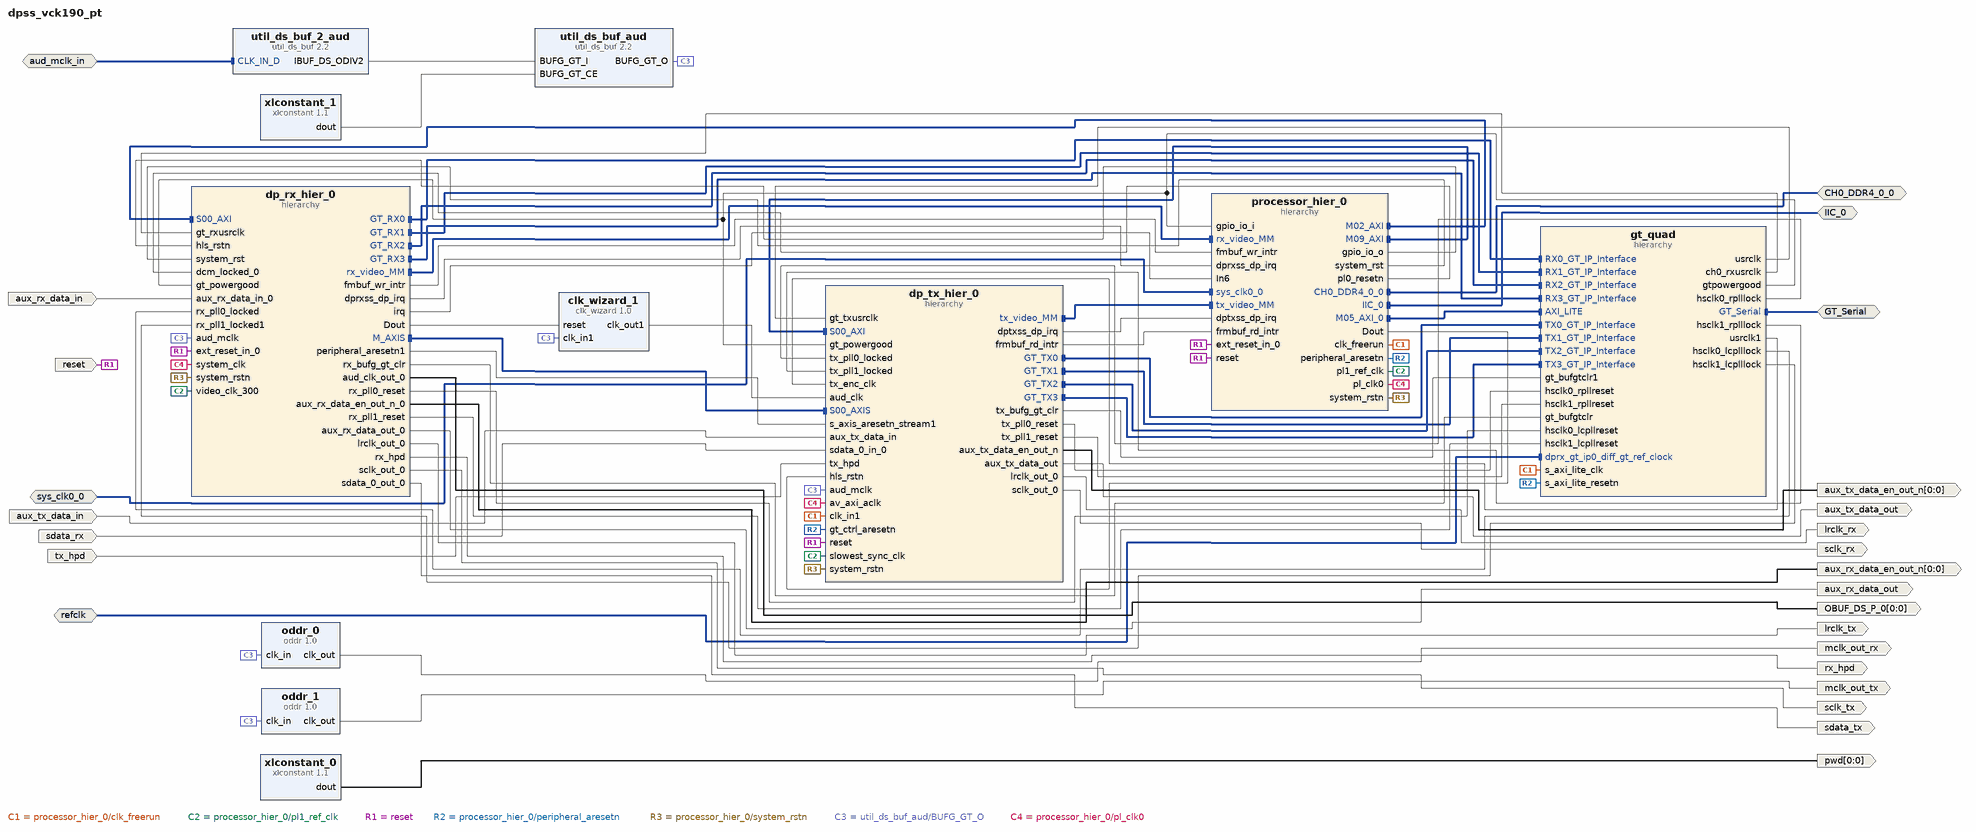
[diagram p0: block diagram of the top level]
# Vivado block design dpss_vck190_pt, xcvc1902-vsva2197-2MP-e-S, Vivado 2023.2
create_bd_design dpss_vck190_pt

create_bd_intf_port -mode Master -vlnv xilinx.com:interface:gt_rtl:1.0 GT_Serial
create_bd_intf_port -mode Master -vlnv xilinx.com:interface:ddr4_rtl:1.0 CH0_DDR4_0_0
create_bd_intf_port -mode Master -vlnv xilinx.com:interface:iic_rtl:1.0 IIC_0
create_bd_intf_port -mode Slave -vlnv xilinx.com:interface:diff_clock_rtl:1.0 aud_mclk_in
set_property -dict {CONFIG.FREQ_HZ 36864000} [get_bd_intf_ports aud_mclk_in]
create_bd_intf_port -mode Slave -vlnv xilinx.com:interface:diff_clock_rtl:1.0 refclk
create_bd_intf_port -mode Slave -vlnv xilinx.com:interface:diff_clock_rtl:1.0 sys_clk0_0
set_property -dict {CONFIG.FREQ_HZ 200000000} [get_bd_intf_ports sys_clk0_0]
create_bd_port -dir O -from 0 -to 0 -type clk OBUF_DS_P_0
create_bd_port -dir O -from 0 -to 0 aux_rx_data_en_out_n
create_bd_port -dir I aux_rx_data_in
create_bd_port -dir O aux_rx_data_out
create_bd_port -dir O -from 0 -to 0 aux_tx_data_en_out_n
create_bd_port -dir I aux_tx_data_in
create_bd_port -dir O aux_tx_data_out
create_bd_port -dir O lrclk_rx
create_bd_port -dir O lrclk_tx
create_bd_port -dir O -type clk mclk_out_rx
create_bd_port -dir O -type clk mclk_out_tx
create_bd_port -dir O -from 0 -to 0 pwd
create_bd_port -dir I -type rst reset
set_property -dict {CONFIG.POLARITY ACTIVE_HIGH} [get_bd_ports reset]
create_bd_port -dir O -type data rx_hpd
create_bd_port -dir O sclk_rx
create_bd_port -dir O sclk_tx
create_bd_port -dir I sdata_rx
create_bd_port -dir O sdata_tx
create_bd_port -dir I -type data tx_hpd

create_bd_cell -type hier gt_quad
create_bd_cell -type ip -vlnv xilinx.com:ip:clk_wizard:1.0 clk_wizard_1
set_property -dict [list \
  CONFIG.CLKOUT_DRIVES BUFG,BUFG,BUFG,BUFG,BUFG,BUFG,BUFG \
  CONFIG.CLKOUT_DYN_PS None,None,None,None,None,None,None \
  CONFIG.CLKOUT_MATCHED_ROUTING false,false,false,false,false,false,false \
  CONFIG.CLKOUT_PORT clk_out1,clk_out2,clk_out3,clk_out4,clk_out5,clk_out6,clk_out7 \
  CONFIG.CLKOUT_REQUESTED_DUTY_CYCLE 50.000,50.000,50.000,50.000,50.000,50.000,50.000 \
  CONFIG.CLKOUT_REQUESTED_OUT_FREQUENCY 24.576,36.864,100.000,100.000,100.000,100.000,100.000 \
  CONFIG.CLKOUT_REQUESTED_PHASE 0.000,0.000,0.000,0.000,0.000,0.000,0.000 \
  CONFIG.CLKOUT_USED true,false,false,false,false,false,false \
  CONFIG.PRIM_IN_FREQ 36.864 \
  CONFIG.PRIM_SOURCE No_buffer \
  CONFIG.USE_RESET true \
] [get_bd_cells clk_wizard_1]
create_bd_cell -type hier dp_rx_hier_0
create_bd_cell -type hier dp_tx_hier_0
create_bd_cell -type ip -vlnv xilinx.com:ip:oddr:1.0 oddr_0
create_bd_cell -type ip -vlnv xilinx.com:ip:oddr:1.0 oddr_1
create_bd_cell -type hier processor_hier_0
create_bd_cell -type ip -vlnv xilinx.com:ip:util_ds_buf:2.2 util_ds_buf_2_aud
set_property -dict {CONFIG.C_BUF_TYPE IBUFDSGTE} [get_bd_cells util_ds_buf_2_aud]
create_bd_cell -type ip -vlnv xilinx.com:ip:util_ds_buf:2.2 util_ds_buf_aud
set_property -dict {CONFIG.C_BUF_TYPE BUFG_GT} [get_bd_cells util_ds_buf_aud]
create_bd_cell -type ip -vlnv xilinx.com:ip:xlconstant:1.1 xlconstant_0
set_property -dict {CONFIG.CONST_VAL 0} [get_bd_cells xlconstant_0]
create_bd_cell -type ip -vlnv xilinx.com:ip:xlconstant:1.1 xlconstant_1

# ---- hierarchy /gt_quad ----
current_bd_instance /gt_quad
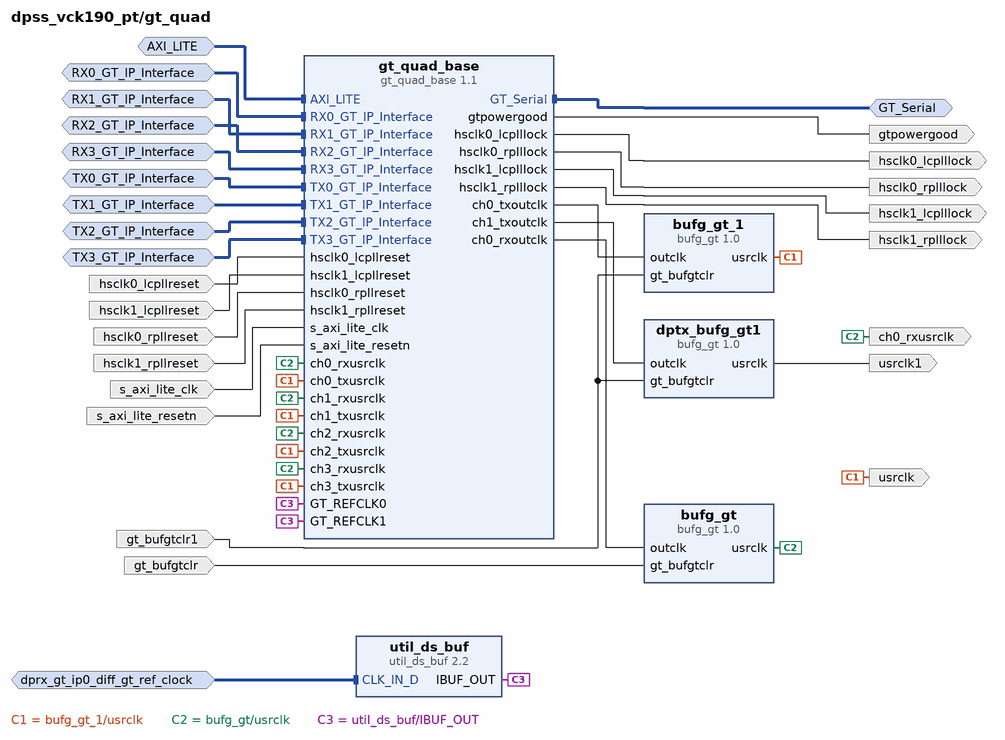
[diagram p1: block diagram inside /gt_quad]
create_bd_intf_pin -mode Slave -vlnv xilinx.com:interface:gt_tx_interface_rtl:1.0 TX0_GT_IP_Interface
create_bd_intf_pin -mode Slave -vlnv xilinx.com:interface:gt_tx_interface_rtl:1.0 TX1_GT_IP_Interface
create_bd_intf_pin -mode Slave -vlnv xilinx.com:interface:gt_tx_interface_rtl:1.0 TX2_GT_IP_Interface
create_bd_intf_pin -mode Slave -vlnv xilinx.com:interface:gt_tx_interface_rtl:1.0 TX3_GT_IP_Interface
create_bd_intf_pin -mode Slave -vlnv xilinx.com:interface:gt_rx_interface_rtl:1.0 RX0_GT_IP_Interface
create_bd_intf_pin -mode Slave -vlnv xilinx.com:interface:gt_rx_interface_rtl:1.0 RX1_GT_IP_Interface
create_bd_intf_pin -mode Slave -vlnv xilinx.com:interface:gt_rx_interface_rtl:1.0 RX2_GT_IP_Interface
create_bd_intf_pin -mode Slave -vlnv xilinx.com:interface:gt_rx_interface_rtl:1.0 RX3_GT_IP_Interface
create_bd_intf_pin -mode Master -vlnv xilinx.com:interface:gt_rtl:1.0 GT_Serial
create_bd_intf_pin -mode Slave -vlnv xilinx.com:interface:diff_clock_rtl:1.0 dprx_gt_ip0_diff_gt_ref_clock
create_bd_intf_pin -mode Slave -vlnv xilinx.com:interface:aximm_rtl:1.0 AXI_LITE
create_bd_pin -dir I gt_bufgtclr
create_bd_pin -dir O -type gt_usrclk ch0_rxusrclk
create_bd_pin -dir I -type rst hsclk0_lcpllreset
create_bd_pin -dir I -type rst hsclk0_rpllreset
create_bd_pin -dir I -type rst hsclk1_lcpllreset
create_bd_pin -dir I -type rst hsclk1_rpllreset
create_bd_pin -dir O hsclk0_lcplllock
create_bd_pin -dir O hsclk1_lcplllock
create_bd_pin -dir O hsclk0_rplllock
create_bd_pin -dir O hsclk1_rplllock
create_bd_pin -dir O gtpowergood
create_bd_pin -dir O -type gt_usrclk usrclk
create_bd_pin -dir I gt_bufgtclr1
create_bd_pin -dir O -type gt_usrclk usrclk1
create_bd_pin -dir I -type clk s_axi_lite_clk
create_bd_pin -dir I -type rst s_axi_lite_resetn

create_bd_cell -type ip -vlnv xilinx.com:ip:bufg_gt:1.0 bufg_gt
create_bd_cell -type ip -vlnv xilinx.com:ip:gt_quad_base:1.1 gt_quad_base
set_property -dict [list \
  CONFIG.APB3_CLK_FREQUENCY 99.999001 \
  CONFIG.CHANNEL_ORDERING {['/gt_quad/gt_quad_base/TX0_GT_IP_Interface dpss_vck190_pt_dptx_gt_ip0_0./dp_tx_hier_0/dptx_gt_ip0/GT_TX0.0 /gt_quad/gt_quad_base/TX1_GT_IP_Interface', 'dpss_vck190_pt_dptx_gt_ip0_0./dp_tx_hier_0/dptx_gt_ip0/GT_TX1.1 /gt_quad/gt_quad_base/TX2_GT_IP_Interface dpss_vck190_pt_dptx_gt_ip0_0./dp_tx_hier_0/dptx_gt_ip0/GT_TX2.2', '/gt_quad/gt_quad_base/TX3_GT_IP_Interface dpss_vck190_pt_dptx_gt_ip0_0./dp_tx_hier_0/dptx_gt_ip0/GT_TX3.3 /gt_quad/gt_quad_base/RX0_GT_IP_Interface', 'dpss_vck190_pt_dprx_gt_ip0_0./dp_rx_hier_0/dprx_gt_ip0/GT_RX0.0 /gt_quad/gt_quad_base/RX1_GT_IP_Interface dpss_vck190_pt_dprx_gt_ip0_0./dp_rx_hier_0/dprx_gt_ip0/GT_RX1.1', '/gt_quad/gt_quad_base/RX2_GT_IP_Interface dpss_vck190_pt_dprx_gt_ip0_0./dp_rx_hier_0/dprx_gt_ip0/GT_RX2.2 /gt_quad/gt_quad_base/RX3_GT_IP_Interface', 'dpss_vck190_pt_dprx_gt_ip0_0./dp_rx_hier_0/dprx_gt_ip0/GT_RX3.3']} \
  CONFIG.GT_TYPE GTY \
  CONFIG.PORTS_INFO_DICT {LANE_SEL_DICT {PROT0 {RX0 RX1 RX2 RX3} PROT1 {TX0 TX1 TX2 TX3}} GT_TYPE GTY REG_CONF_INTF AXI_LITE BOARD_PARAMETER { }} \
  CONFIG.PROT0_ENABLE true \
  CONFIG.PROT0_GT_DIRECTION SIMPLEX_RX \
  CONFIG.PROT0_LR0_SETTINGS {['TX_PAM_SEL NRZ TX_HD_EN 0 TX_GRAY_BYP true TX_GRAY_LITTLEENDIAN true TX_PRECODE_BYP true TX_PRECODE_LITTLEENDIAN false TX_LINE_RATE 10.3125 TX_PLL_TYPE LCPLL TX_REFCLK_FREQUENCY 156.25', 'TX_ACTUAL_REFCLK_FREQUENCY 156.250000000000 TX_FRACN_ENABLED false TX_FRACN_OVRD false TX_FRACN_NUMERATOR 0 TX_REFCLK_SOURCE R0 TX_DATA_ENCODING RAW TX_USER_DATA_WIDTH 32 TX_INT_DATA_WIDTH 32', 'TX_BUFFER_MODE 1 TX_BUFFER_BYPASS_MODE Fast_Sync TX_PIPM_ENABLE false TX_OUTCLK_SOURCE TXOUTCLKPMA TXPROGDIV_FREQ_ENABLE false TXPROGDIV_FREQ_SOURCE LCPLL TXPROGDIV_FREQ_VAL 322.265625', 'TX_DIFF_SWING_EMPH_MODE CUSTOM TX_64B66B_SCRAMBLER false TX_64B66B_ENCODER false TX_64B66B_CRC false TX_RATE_GROUP A TX_LANE_DESKEW_HDMI_ENABLE false TX_BUFFER_RESET_ON_RATE_CHANGE ENABLE GT_DIRECTION', 'SIMPLEX_RX PRESET None RX_PAM_SEL NRZ RX_HD_EN 0 RX_GRAY_BYP true RX_GRAY_LITTLEENDIAN true RX_PRECODE_BYP true RX_PRECODE_LITTLEENDIAN false INTERNAL_PRESET None RX_LINE_RATE 1.62 RX_PLL_TYPE LCPLL', 'RX_REFCLK_FREQUENCY 270 RX_ACTUAL_REFCLK_FREQUENCY 270.000000000000 RX_FRACN_ENABLED false RX_FRACN_OVRD false RX_FRACN_NUMERATOR 0 RX_REFCLK_SOURCE R0 RX_DATA_DECODING RAW RX_USER_DATA_WIDTH 16', 'RX_INT_DATA_WIDTH 16 RX_BUFFER_MODE 1 RX_OUTCLK_SOURCE RXPROGDIVCLK RXPROGDIV_FREQ_ENABLE true RXPROGDIV_FREQ_SOURCE LCPLL RXPROGDIV_FREQ_VAL 101.250 RXRECCLK_FREQ_ENABLE true RXRECCLK_FREQ_VAL', '810.000 INS_LOSS_NYQ 14 RX_EQ_MODE LPM RX_COUPLING AC RX_TERMINATION PROGRAMMABLE RX_RATE_GROUP A RX_TERMINATION_PROG_VALUE 800 RX_PPM_OFFSET 300 RX_64B66B_DESCRAMBLER false RX_64B66B_DECODER false', 'RX_64B66B_CRC false OOB_ENABLE false RX_COMMA_ALIGN_WORD 1 RX_COMMA_SHOW_REALIGN_ENABLE true PCIE_ENABLE false RX_COMMA_P_ENABLE false RX_COMMA_M_ENABLE false RX_COMMA_DOUBLE_ENABLE false', 'RX_COMMA_P_VAL 0101111100 RX_COMMA_M_VAL 1010000011 RX_COMMA_MASK 0000000000 RX_SLIDE_MODE OFF RX_SSC_PPM 5000 RX_CB_NUM_SEQ 0 RX_CB_LEN_SEQ 1 RX_CB_MAX_SKEW 1 RX_CB_MAX_LEVEL 1 RX_CB_MASK 00000000', 'RX_CB_VAL 00000000000000000000000000000000000000000000000000000000000000000000000000000000 RX_CB_K 00000000 RX_CB_DISP 00000000 RX_CB_MASK_0_0 false RX_CB_VAL_0_0 00000000 RX_CB_K_0_0 false', 'RX_CB_DISP_0_0 false RX_CB_MASK_0_1 false RX_CB_VAL_0_1 00000000 RX_CB_K_0_1 false RX_CB_DISP_0_1 false RX_CB_MASK_0_2 false RX_CB_VAL_0_2 00000000 RX_CB_K_0_2 false RX_CB_DISP_0_2 false', 'RX_CB_MASK_0_3 false RX_CB_VAL_0_3 00000000 RX_CB_K_0_3 false RX_CB_DISP_0_3 false RX_CB_MASK_1_0 false RX_CB_VAL_1_0 00000000 RX_CB_K_1_0 false RX_CB_DISP_1_0 false RX_CB_MASK_1_1 false RX_CB_VAL_1_1', '00000000 RX_CB_K_1_1 false RX_CB_DISP_1_1 false RX_CB_MASK_1_2 false RX_CB_VAL_1_2 00000000 RX_CB_K_1_2 false RX_CB_DISP_1_2 false RX_CB_MASK_1_3 false RX_CB_VAL_1_3 00000000 RX_CB_K_1_3 false', 'RX_CB_DISP_1_3 false RX_CC_NUM_SEQ 0 RX_CC_LEN_SEQ 1 RX_CC_PERIODICITY 5000 RX_CC_KEEP_IDLE DISABLE RX_CC_PRECEDENCE ENABLE RX_CC_REPEAT_WAIT 0 RX_CC_MASK 00000000 RX_CC_VAL', '00000000000000000000000000000000000000000000000000000000000000000000000000000000 RX_CC_K 00000000 RX_CC_DISP 00000000 RX_CC_MASK_0_0 false RX_CC_VAL_0_0 00000000 RX_CC_K_0_0 false RX_CC_DISP_0_0 false', 'RX_CC_MASK_0_1 false RX_CC_VAL_0_1 00000000 RX_CC_K_0_1 false RX_CC_DISP_0_1 false RX_CC_MASK_0_2 false RX_CC_VAL_0_2 00000000 RX_CC_K_0_2 false RX_CC_DISP_0_2 false RX_CC_MASK_0_3 false RX_CC_VAL_0_3', '00000000 RX_CC_K_0_3 false RX_CC_DISP_0_3 false RX_CC_MASK_1_0 false RX_CC_VAL_1_0 00000000 RX_CC_K_1_0 false RX_CC_DISP_1_0 false RX_CC_MASK_1_1 false RX_CC_VAL_1_1 00000000 RX_CC_K_1_1 false', 'RX_CC_DISP_1_1 false RX_CC_MASK_1_2 false RX_CC_VAL_1_2 00000000 RX_CC_K_1_2 false RX_CC_DISP_1_2 false RX_CC_MASK_1_3 false RX_CC_VAL_1_3 00000000 RX_CC_K_1_3 false RX_CC_DISP_1_3 false', 'PCIE_USERCLK2_FREQ 250 PCIE_USERCLK_FREQ 250 RX_JTOL_FC 0.9718056 RX_JTOL_LF_SLOPE -20 RX_BUFFER_BYPASS_MODE Fast_Sync RX_BUFFER_BYPASS_MODE_LANE MULTI RX_BUFFER_RESET_ON_CB_CHANGE ENABLE', 'RX_BUFFER_RESET_ON_COMMAALIGN DISABLE RX_BUFFER_RESET_ON_RATE_CHANGE ENABLE RESET_SEQUENCE_INTERVAL 0 RX_COMMA_PRESET NONE RX_COMMA_VALID_ONLY 0 GT_TYPE GTY']} \
  CONFIG.PROT0_LR10_SETTINGS {NA NA} \
  CONFIG.PROT0_LR11_SETTINGS {NA NA} \
  CONFIG.PROT0_LR12_SETTINGS {NA NA} \
  CONFIG.PROT0_LR13_SETTINGS {NA NA} \
  CONFIG.PROT0_LR14_SETTINGS {NA NA} \
  CONFIG.PROT0_LR15_SETTINGS {NA NA} \
  CONFIG.PROT0_LR1_SETTINGS {['TX_PAM_SEL NRZ TX_HD_EN 0 TX_GRAY_BYP true TX_GRAY_LITTLEENDIAN true TX_PRECODE_BYP true TX_PRECODE_LITTLEENDIAN false TX_LINE_RATE 10.3125 TX_PLL_TYPE LCPLL TX_REFCLK_FREQUENCY 156.25', 'TX_ACTUAL_REFCLK_FREQUENCY 156.250000000000 TX_FRACN_ENABLED false TX_FRACN_OVRD false TX_FRACN_NUMERATOR 0 TX_REFCLK_SOURCE R0 TX_DATA_ENCODING RAW TX_USER_DATA_WIDTH 32 TX_INT_DATA_WIDTH 32', 'TX_BUFFER_MODE 1 TX_BUFFER_BYPASS_MODE Fast_Sync TX_PIPM_ENABLE false TX_OUTCLK_SOURCE TXOUTCLKPMA TXPROGDIV_FREQ_ENABLE false TXPROGDIV_FREQ_SOURCE LCPLL TXPROGDIV_FREQ_VAL 322.265625', 'TX_DIFF_SWING_EMPH_MODE CUSTOM TX_64B66B_SCRAMBLER false TX_64B66B_ENCODER false TX_64B66B_CRC false TX_RATE_GROUP A TX_LANE_DESKEW_HDMI_ENABLE false TX_BUFFER_RESET_ON_RATE_CHANGE ENABLE GT_DIRECTION', 'SIMPLEX_RX PRESET None RX_PAM_SEL NRZ RX_HD_EN 0 RX_GRAY_BYP true RX_GRAY_LITTLEENDIAN true RX_PRECODE_BYP true RX_PRECODE_LITTLEENDIAN false INTERNAL_PRESET None RX_LINE_RATE 2.7 RX_PLL_TYPE LCPLL', 'RX_REFCLK_FREQUENCY 270 RX_ACTUAL_REFCLK_FREQUENCY 270.000000000000 RX_FRACN_ENABLED false RX_FRACN_OVRD false RX_FRACN_NUMERATOR 0 RX_REFCLK_SOURCE R0 RX_DATA_DECODING RAW RX_USER_DATA_WIDTH 16', 'RX_INT_DATA_WIDTH 16 RX_BUFFER_MODE 1 RX_OUTCLK_SOURCE RXPROGDIVCLK RXPROGDIV_FREQ_ENABLE true RXPROGDIV_FREQ_SOURCE LCPLL RXPROGDIV_FREQ_VAL 168.750 RXRECCLK_FREQ_ENABLE true RXRECCLK_FREQ_VAL', '675.000 INS_LOSS_NYQ 14 RX_EQ_MODE LPM RX_COUPLING AC RX_TERMINATION PROGRAMMABLE RX_RATE_GROUP A RX_TERMINATION_PROG_VALUE 800 RX_PPM_OFFSET 300 RX_64B66B_DESCRAMBLER false RX_64B66B_DECODER false', 'RX_64B66B_CRC false OOB_ENABLE false RX_COMMA_ALIGN_WORD 1 RX_COMMA_SHOW_REALIGN_ENABLE true PCIE_ENABLE false RX_COMMA_P_ENABLE false RX_COMMA_M_ENABLE false RX_COMMA_DOUBLE_ENABLE false', 'RX_COMMA_P_VAL 0101111100 RX_COMMA_M_VAL 1010000011 RX_COMMA_MASK 0000000000 RX_SLIDE_MODE OFF RX_SSC_PPM 5000 RX_CB_NUM_SEQ 0 RX_CB_LEN_SEQ 1 RX_CB_MAX_SKEW 1 RX_CB_MAX_LEVEL 1 RX_CB_MASK 00000000', 'RX_CB_VAL 00000000000000000000000000000000000000000000000000000000000000000000000000000000 RX_CB_K 00000000 RX_CB_DISP 00000000 RX_CB_MASK_0_0 false RX_CB_VAL_0_0 00000000 RX_CB_K_0_0 false', 'RX_CB_DISP_0_0 false RX_CB_MASK_0_1 false RX_CB_VAL_0_1 00000000 RX_CB_K_0_1 false RX_CB_DISP_0_1 false RX_CB_MASK_0_2 false RX_CB_VAL_0_2 00000000 RX_CB_K_0_2 false RX_CB_DISP_0_2 false', 'RX_CB_MASK_0_3 false RX_CB_VAL_0_3 00000000 RX_CB_K_0_3 false RX_CB_DISP_0_3 false RX_CB_MASK_1_0 false RX_CB_VAL_1_0 00000000 RX_CB_K_1_0 false RX_CB_DISP_1_0 false RX_CB_MASK_1_1 false RX_CB_VAL_1_1', '00000000 RX_CB_K_1_1 false RX_CB_DISP_1_1 false RX_CB_MASK_1_2 false RX_CB_VAL_1_2 00000000 RX_CB_K_1_2 false RX_CB_DISP_1_2 false RX_CB_MASK_1_3 false RX_CB_VAL_1_3 00000000 RX_CB_K_1_3 false', 'RX_CB_DISP_1_3 false RX_CC_NUM_SEQ 0 RX_CC_LEN_SEQ 1 RX_CC_PERIODICITY 5000 RX_CC_KEEP_IDLE DISABLE RX_CC_PRECEDENCE ENABLE RX_CC_REPEAT_WAIT 0 RX_CC_MASK 00000000 RX_CC_VAL', '00000000000000000000000000000000000000000000000000000000000000000000000000000000 RX_CC_K 00000000 RX_CC_DISP 00000000 RX_CC_MASK_0_0 false RX_CC_VAL_0_0 00000000 RX_CC_K_0_0 false RX_CC_DISP_0_0 false', 'RX_CC_MASK_0_1 false RX_CC_VAL_0_1 00000000 RX_CC_K_0_1 false RX_CC_DISP_0_1 false RX_CC_MASK_0_2 false RX_CC_VAL_0_2 00000000 RX_CC_K_0_2 false RX_CC_DISP_0_2 false RX_CC_MASK_0_3 false RX_CC_VAL_0_3', '00000000 RX_CC_K_0_3 false RX_CC_DISP_0_3 false RX_CC_MASK_1_0 false RX_CC_VAL_1_0 00000000 RX_CC_K_1_0 false RX_CC_DISP_1_0 false RX_CC_MASK_1_1 false RX_CC_VAL_1_1 00000000 RX_CC_K_1_1 false', 'RX_CC_DISP_1_1 false RX_CC_MASK_1_2 false RX_CC_VAL_1_2 00000000 RX_CC_K_1_2 false RX_CC_DISP_1_2 false RX_CC_MASK_1_3 false RX_CC_VAL_1_3 00000000 RX_CC_K_1_3 false RX_CC_DISP_1_3 false', 'PCIE_USERCLK2_FREQ 250 PCIE_USERCLK_FREQ 250 RX_JTOL_FC 1.6196761 RX_JTOL_LF_SLOPE -20 RX_BUFFER_BYPASS_MODE Fast_Sync RX_BUFFER_BYPASS_MODE_LANE MULTI RX_BUFFER_RESET_ON_CB_CHANGE ENABLE', 'RX_BUFFER_RESET_ON_COMMAALIGN DISABLE RX_BUFFER_RESET_ON_RATE_CHANGE ENABLE RESET_SEQUENCE_INTERVAL 0 RX_COMMA_PRESET NONE RX_COMMA_VALID_ONLY 0 GT_TYPE GTY']} \
  CONFIG.PROT0_LR2_SETTINGS {['TX_PAM_SEL NRZ TX_HD_EN 0 TX_GRAY_BYP true TX_GRAY_LITTLEENDIAN true TX_PRECODE_BYP true TX_PRECODE_LITTLEENDIAN false TX_LINE_RATE 10.3125 TX_PLL_TYPE LCPLL TX_REFCLK_FREQUENCY 156.25', 'TX_ACTUAL_REFCLK_FREQUENCY 156.250000000000 TX_FRACN_ENABLED false TX_FRACN_OVRD false TX_FRACN_NUMERATOR 0 TX_REFCLK_SOURCE R0 TX_DATA_ENCODING RAW TX_USER_DATA_WIDTH 32 TX_INT_DATA_WIDTH 32', 'TX_BUFFER_MODE 1 TX_BUFFER_BYPASS_MODE Fast_Sync TX_PIPM_ENABLE false TX_OUTCLK_SOURCE TXOUTCLKPMA TXPROGDIV_FREQ_ENABLE false TXPROGDIV_FREQ_SOURCE LCPLL TXPROGDIV_FREQ_VAL 322.265625', 'TX_DIFF_SWING_EMPH_MODE CUSTOM TX_64B66B_SCRAMBLER false TX_64B66B_ENCODER false TX_64B66B_CRC false TX_RATE_GROUP A TX_LANE_DESKEW_HDMI_ENABLE false TX_BUFFER_RESET_ON_RATE_CHANGE ENABLE GT_DIRECTION', 'SIMPLEX_RX PRESET None RX_PAM_SEL NRZ RX_HD_EN 0 RX_GRAY_BYP true RX_GRAY_LITTLEENDIAN true RX_PRECODE_BYP true RX_PRECODE_LITTLEENDIAN false INTERNAL_PRESET None RX_LINE_RATE 5.4 RX_PLL_TYPE LCPLL', 'RX_REFCLK_FREQUENCY 270 RX_ACTUAL_REFCLK_FREQUENCY 270.000000000000 RX_FRACN_ENABLED false RX_FRACN_OVRD false RX_FRACN_NUMERATOR 0 RX_REFCLK_SOURCE R0 RX_DATA_DECODING RAW RX_USER_DATA_WIDTH 16', 'RX_INT_DATA_WIDTH 16 RX_BUFFER_MODE 1 RX_OUTCLK_SOURCE RXPROGDIVCLK RXPROGDIV_FREQ_ENABLE true RXPROGDIV_FREQ_SOURCE LCPLL RXPROGDIV_FREQ_VAL 337.500 RXRECCLK_FREQ_ENABLE true RXRECCLK_FREQ_VAL', '675.000 INS_LOSS_NYQ 14 RX_EQ_MODE LPM RX_COUPLING AC RX_TERMINATION PROGRAMMABLE RX_RATE_GROUP A RX_TERMINATION_PROG_VALUE 800 RX_PPM_OFFSET 300 RX_64B66B_DESCRAMBLER false RX_64B66B_DECODER false', 'RX_64B66B_CRC false OOB_ENABLE false RX_COMMA_ALIGN_WORD 1 RX_COMMA_SHOW_REALIGN_ENABLE true PCIE_ENABLE false RX_COMMA_P_ENABLE false RX_COMMA_M_ENABLE false RX_COMMA_DOUBLE_ENABLE false', 'RX_COMMA_P_VAL 0101111100 RX_COMMA_M_VAL 1010000011 RX_COMMA_MASK 0000000000 RX_SLIDE_MODE OFF RX_SSC_PPM 5000 RX_CB_NUM_SEQ 0 RX_CB_LEN_SEQ 1 RX_CB_MAX_SKEW 1 RX_CB_MAX_LEVEL 1 RX_CB_MASK 00000000', 'RX_CB_VAL 00000000000000000000000000000000000000000000000000000000000000000000000000000000 RX_CB_K 00000000 RX_CB_DISP 00000000 RX_CB_MASK_0_0 false RX_CB_VAL_0_0 00000000 RX_CB_K_0_0 false', 'RX_CB_DISP_0_0 false RX_CB_MASK_0_1 false RX_CB_VAL_0_1 00000000 RX_CB_K_0_1 false RX_CB_DISP_0_1 false RX_CB_MASK_0_2 false RX_CB_VAL_0_2 00000000 RX_CB_K_0_2 false RX_CB_DISP_0_2 false', 'RX_CB_MASK_0_3 false RX_CB_VAL_0_3 00000000 RX_CB_K_0_3 false RX_CB_DISP_0_3 false RX_CB_MASK_1_0 false RX_CB_VAL_1_0 00000000 RX_CB_K_1_0 false RX_CB_DISP_1_0 false RX_CB_MASK_1_1 false RX_CB_VAL_1_1', '00000000 RX_CB_K_1_1 false RX_CB_DISP_1_1 false RX_CB_MASK_1_2 false RX_CB_VAL_1_2 00000000 RX_CB_K_1_2 false RX_CB_DISP_1_2 false RX_CB_MASK_1_3 false RX_CB_VAL_1_3 00000000 RX_CB_K_1_3 false', 'RX_CB_DISP_1_3 false RX_CC_NUM_SEQ 0 RX_CC_LEN_SEQ 1 RX_CC_PERIODICITY 5000 RX_CC_KEEP_IDLE DISABLE RX_CC_PRECEDENCE ENABLE RX_CC_REPEAT_WAIT 0 RX_CC_MASK 00000000 RX_CC_VAL', '00000000000000000000000000000000000000000000000000000000000000000000000000000000 RX_CC_K 00000000 RX_CC_DISP 00000000 RX_CC_MASK_0_0 false RX_CC_VAL_0_0 00000000 RX_CC_K_0_0 false RX_CC_DISP_0_0 false', 'RX_CC_MASK_0_1 false RX_CC_VAL_0_1 00000000 RX_CC_K_0_1 false RX_CC_DISP_0_1 false RX_CC_MASK_0_2 false RX_CC_VAL_0_2 00000000 RX_CC_K_0_2 false RX_CC_DISP_0_2 false RX_CC_MASK_0_3 false RX_CC_VAL_0_3', '00000000 RX_CC_K_0_3 false RX_CC_DISP_0_3 false RX_CC_MASK_1_0 false RX_CC_VAL_1_0 00000000 RX_CC_K_1_0 false RX_CC_DISP_1_0 false RX_CC_MASK_1_1 false RX_CC_VAL_1_1 00000000 RX_CC_K_1_1 false', 'RX_CC_DISP_1_1 false RX_CC_MASK_1_2 false RX_CC_VAL_1_2 00000000 RX_CC_K_1_2 false RX_CC_DISP_1_2 false RX_CC_MASK_1_3 false RX_CC_VAL_1_3 00000000 RX_CC_K_1_3 false RX_CC_DISP_1_3 false', 'PCIE_USERCLK2_FREQ 250 PCIE_USERCLK_FREQ 250 RX_JTOL_FC 3.2393521 RX_JTOL_LF_SLOPE -20 RX_BUFFER_BYPASS_MODE Fast_Sync RX_BUFFER_BYPASS_MODE_LANE MULTI RX_BUFFER_RESET_ON_CB_CHANGE ENABLE', 'RX_BUFFER_RESET_ON_COMMAALIGN DISABLE RX_BUFFER_RESET_ON_RATE_CHANGE ENABLE RESET_SEQUENCE_INTERVAL 0 RX_COMMA_PRESET NONE RX_COMMA_VALID_ONLY 0 GT_TYPE GTY']} \
  CONFIG.PROT0_LR3_SETTINGS {['TX_PAM_SEL NRZ TX_HD_EN 0 TX_GRAY_BYP true TX_GRAY_LITTLEENDIAN true TX_PRECODE_BYP true TX_PRECODE_LITTLEENDIAN false TX_LINE_RATE 10.3125 TX_PLL_TYPE LCPLL TX_REFCLK_FREQUENCY 156.25', 'TX_ACTUAL_REFCLK_FREQUENCY 156.250000000000 TX_FRACN_ENABLED false TX_FRACN_OVRD false TX_FRACN_NUMERATOR 0 TX_REFCLK_SOURCE R0 TX_DATA_ENCODING RAW TX_USER_DATA_WIDTH 32 TX_INT_DATA_WIDTH 32', 'TX_BUFFER_MODE 1 TX_BUFFER_BYPASS_MODE Fast_Sync TX_PIPM_ENABLE false TX_OUTCLK_SOURCE TXOUTCLKPMA TXPROGDIV_FREQ_ENABLE false TXPROGDIV_FREQ_SOURCE LCPLL TXPROGDIV_FREQ_VAL 322.265625', 'TX_DIFF_SWING_EMPH_MODE CUSTOM TX_64B66B_SCRAMBLER false TX_64B66B_ENCODER false TX_64B66B_CRC false TX_RATE_GROUP A TX_LANE_DESKEW_HDMI_ENABLE false TX_BUFFER_RESET_ON_RATE_CHANGE ENABLE GT_DIRECTION', 'SIMPLEX_RX PRESET None RX_PAM_SEL NRZ RX_HD_EN 0 RX_GRAY_BYP true RX_GRAY_LITTLEENDIAN true RX_PRECODE_BYP true RX_PRECODE_LITTLEENDIAN false INTERNAL_PRESET None RX_LINE_RATE 8.1 RX_PLL_TYPE LCPLL', 'RX_REFCLK_FREQUENCY 270 RX_ACTUAL_REFCLK_FREQUENCY 270.000000000000 RX_FRACN_ENABLED false RX_FRACN_OVRD false RX_FRACN_NUMERATOR 0 RX_REFCLK_SOURCE R0 RX_DATA_DECODING RAW RX_USER_DATA_WIDTH 16', 'RX_INT_DATA_WIDTH 16 RX_BUFFER_MODE 1 RX_OUTCLK_SOURCE RXPROGDIVCLK RXPROGDIV_FREQ_ENABLE true RXPROGDIV_FREQ_SOURCE LCPLL RXPROGDIV_FREQ_VAL 506.250 RXRECCLK_FREQ_ENABLE true RXRECCLK_FREQ_VAL', '506.250 INS_LOSS_NYQ 14 RX_EQ_MODE LPM RX_COUPLING AC RX_TERMINATION PROGRAMMABLE RX_RATE_GROUP A RX_TERMINATION_PROG_VALUE 800 RX_PPM_OFFSET 300 RX_64B66B_DESCRAMBLER false RX_64B66B_DECODER false', 'RX_64B66B_CRC false OOB_ENABLE false RX_COMMA_ALIGN_WORD 1 RX_COMMA_SHOW_REALIGN_ENABLE true PCIE_ENABLE false RX_COMMA_P_ENABLE false RX_COMMA_M_ENABLE false RX_COMMA_DOUBLE_ENABLE false', 'RX_COMMA_P_VAL 0101111100 RX_COMMA_M_VAL 1010000011 RX_COMMA_MASK 0000000000 RX_SLIDE_MODE OFF RX_SSC_PPM 0 RX_CB_NUM_SEQ 0 RX_CB_LEN_SEQ 1 RX_CB_MAX_SKEW 1 RX_CB_MAX_LEVEL 1 RX_CB_MASK 00000000', 'RX_CB_VAL 00000000000000000000000000000000000000000000000000000000000000000000000000000000 RX_CB_K 00000000 RX_CB_DISP 00000000 RX_CB_MASK_0_0 false RX_CB_VAL_0_0 00000000 RX_CB_K_0_0 false', 'RX_CB_DISP_0_0 false RX_CB_MASK_0_1 false RX_CB_VAL_0_1 00000000 RX_CB_K_0_1 false RX_CB_DISP_0_1 false RX_CB_MASK_0_2 false RX_CB_VAL_0_2 00000000 RX_CB_K_0_2 false RX_CB_DISP_0_2 false', 'RX_CB_MASK_0_3 false RX_CB_VAL_0_3 00000000 RX_CB_K_0_3 false RX_CB_DISP_0_3 false RX_CB_MASK_1_0 false RX_CB_VAL_1_0 00000000 RX_CB_K_1_0 false RX_CB_DISP_1_0 false RX_CB_MASK_1_1 false RX_CB_VAL_1_1', '00000000 RX_CB_K_1_1 false RX_CB_DISP_1_1 false RX_CB_MASK_1_2 false RX_CB_VAL_1_2 00000000 RX_CB_K_1_2 false RX_CB_DISP_1_2 false RX_CB_MASK_1_3 false RX_CB_VAL_1_3 00000000 RX_CB_K_1_3 false', 'RX_CB_DISP_1_3 false RX_CC_NUM_SEQ 0 RX_CC_LEN_SEQ 1 RX_CC_PERIODICITY 5000 RX_CC_KEEP_IDLE DISABLE RX_CC_PRECEDENCE ENABLE RX_CC_REPEAT_WAIT 0 RX_CC_MASK 00000000 RX_CC_VAL', '00000000000000000000000000000000000000000000000000000000000000000000000000000000 RX_CC_K 00000000 RX_CC_DISP 00000000 RX_CC_MASK_0_0 false RX_CC_VAL_0_0 00000000 RX_CC_K_0_0 false RX_CC_DISP_0_0 false', 'RX_CC_MASK_0_1 false RX_CC_VAL_0_1 00000000 RX_CC_K_0_1 false RX_CC_DISP_0_1 false RX_CC_MASK_0_2 false RX_CC_VAL_0_2 00000000 RX_CC_K_0_2 false RX_CC_DISP_0_2 false RX_CC_MASK_0_3 false RX_CC_VAL_0_3', '00000000 RX_CC_K_0_3 false RX_CC_DISP_0_3 false RX_CC_MASK_1_0 false RX_CC_VAL_1_0 00000000 RX_CC_K_1_0 false RX_CC_DISP_1_0 false RX_CC_MASK_1_1 false RX_CC_VAL_1_1 00000000 RX_CC_K_1_1 false', 'RX_CC_DISP_1_1 false RX_CC_MASK_1_2 false RX_CC_VAL_1_2 00000000 RX_CC_K_1_2 false RX_CC_DISP_1_2 false RX_CC_MASK_1_3 false RX_CC_VAL_1_3 00000000 RX_CC_K_1_3 false RX_CC_DISP_1_3 false', 'PCIE_USERCLK2_FREQ 250 PCIE_USERCLK_FREQ 250 RX_JTOL_FC 4.8590282 RX_JTOL_LF_SLOPE -20 RX_BUFFER_BYPASS_MODE Fast_Sync RX_BUFFER_BYPASS_MODE_LANE MULTI RX_BUFFER_RESET_ON_CB_CHANGE ENABLE', 'RX_BUFFER_RESET_ON_COMMAALIGN DISABLE RX_BUFFER_RESET_ON_RATE_CHANGE ENABLE RESET_SEQUENCE_INTERVAL 0 RX_COMMA_PRESET NONE RX_COMMA_VALID_ONLY 0 GT_TYPE GTY']} \
  CONFIG.PROT0_LR4_SETTINGS {NA NA} \
  CONFIG.PROT0_LR5_SETTINGS {NA NA} \
  CONFIG.PROT0_LR6_SETTINGS {NA NA} \
  CONFIG.PROT0_LR7_SETTINGS {NA NA} \
  CONFIG.PROT0_LR8_SETTINGS {NA NA} \
  CONFIG.PROT0_LR9_SETTINGS {NA NA} \
  CONFIG.PROT0_NO_OF_RX_LANES 4 \
  CONFIG.PROT0_RX_MASTERCLK_SRC RX0 \
  CONFIG.PROT0_TX_MASTERCLK_SRC None \
  CONFIG.PROT1_ENABLE true \
  CONFIG.PROT1_GT_DIRECTION SIMPLEX_TX \
  CONFIG.PROT1_LR0_SETTINGS {['PRESET None RX_PAM_SEL NRZ RX_HD_EN 0 RX_GRAY_BYP true RX_GRAY_LITTLEENDIAN true RX_PRECODE_BYP true RX_PRECODE_LITTLEENDIAN false INTERNAL_PRESET None RX_LINE_RATE 10.3125 RX_PLL_TYPE LCPLL', 'RX_REFCLK_FREQUENCY 156.25 RX_ACTUAL_REFCLK_FREQUENCY 156.250000000000 RX_FRACN_ENABLED false RX_FRACN_OVRD false RX_FRACN_NUMERATOR 0 RX_REFCLK_SOURCE R0 RX_DATA_DECODING RAW RX_USER_DATA_WIDTH 32', 'RX_INT_DATA_WIDTH 32 RX_BUFFER_MODE 1 RX_OUTCLK_SOURCE RXOUTCLKPMA RXPROGDIV_FREQ_ENABLE false RXPROGDIV_FREQ_SOURCE LCPLL RXPROGDIV_FREQ_VAL 322.265625 RXRECCLK_FREQ_ENABLE false RXRECCLK_FREQ_VAL 0', 'INS_LOSS_NYQ 20 RX_EQ_MODE AUTO RX_COUPLING AC RX_TERMINATION PROGRAMMABLE RX_RATE_GROUP A RX_TERMINATION_PROG_VALUE 800 RX_PPM_OFFSET 0 RX_64B66B_DESCRAMBLER false RX_64B66B_DECODER false', 'RX_64B66B_CRC false OOB_ENABLE false RX_COMMA_ALIGN_WORD 1 RX_COMMA_SHOW_REALIGN_ENABLE true PCIE_ENABLE false RX_COMMA_P_ENABLE false RX_COMMA_M_ENABLE false RX_COMMA_DOUBLE_ENABLE false', 'RX_COMMA_P_VAL 0101111100 RX_COMMA_M_VAL 1010000011 RX_COMMA_MASK 0000000000 RX_SLIDE_MODE OFF RX_SSC_PPM 0 RX_CB_NUM_SEQ 0 RX_CB_LEN_SEQ 1 RX_CB_MAX_SKEW 1 RX_CB_MAX_LEVEL 1 RX_CB_MASK 00000000', 'RX_CB_VAL 00000000000000000000000000000000000000000000000000000000000000000000000000000000 RX_CB_K 00000000 RX_CB_DISP 00000000 RX_CB_MASK_0_0 false RX_CB_VAL_0_0 00000000 RX_CB_K_0_0 false', 'RX_CB_DISP_0_0 false RX_CB_MASK_0_1 false RX_CB_VAL_0_1 00000000 RX_CB_K_0_1 false RX_CB_DISP_0_1 false RX_CB_MASK_0_2 false RX_CB_VAL_0_2 00000000 RX_CB_K_0_2 false RX_CB_DISP_0_2 false', 'RX_CB_MASK_0_3 false RX_CB_VAL_0_3 00000000 RX_CB_K_0_3 false RX_CB_DISP_0_3 false RX_CB_MASK_1_0 false RX_CB_VAL_1_0 00000000 RX_CB_K_1_0 false RX_CB_DISP_1_0 false RX_CB_MASK_1_1 false RX_CB_VAL_1_1', '00000000 RX_CB_K_1_1 false RX_CB_DISP_1_1 false RX_CB_MASK_1_2 false RX_CB_VAL_1_2 00000000 RX_CB_K_1_2 false RX_CB_DISP_1_2 false RX_CB_MASK_1_3 false RX_CB_VAL_1_3 00000000 RX_CB_K_1_3 false', 'RX_CB_DISP_1_3 false RX_CC_NUM_SEQ 0 RX_CC_LEN_SEQ 1 RX_CC_PERIODICITY 5000 RX_CC_KEEP_IDLE DISABLE RX_CC_PRECEDENCE ENABLE RX_CC_REPEAT_WAIT 0 RX_CC_MASK 00000000 RX_CC_VAL', '00000000000000000000000000000000000000000000000000000000000000000000000000000000 RX_CC_K 00000000 RX_CC_DISP 00000000 RX_CC_MASK_0_0 false RX_CC_VAL_0_0 00000000 RX_CC_K_0_0 false RX_CC_DISP_0_0 false', 'RX_CC_MASK_0_1 false RX_CC_VAL_0_1 00000000 RX_CC_K_0_1 false RX_CC_DISP_0_1 false RX_CC_MASK_0_2 false RX_CC_VAL_0_2 00000000 RX_CC_K_0_2 false RX_CC_DISP_0_2 false RX_CC_MASK_0_3 false RX_CC_VAL_0_3', '00000000 RX_CC_K_0_3 false RX_CC_DISP_0_3 false RX_CC_MASK_1_0 false RX_CC_VAL_1_0 00000000 RX_CC_K_1_0 false RX_CC_DISP_1_0 false RX_CC_MASK_1_1 false RX_CC_VAL_1_1 00000000 RX_CC_K_1_1 false', 'RX_CC_DISP_1_1 false RX_CC_MASK_1_2 false RX_CC_VAL_1_2 00000000 RX_CC_K_1_2 false RX_CC_DISP_1_2 false RX_CC_MASK_1_3 false RX_CC_VAL_1_3 00000000 RX_CC_K_1_3 false RX_CC_DISP_1_3 false', 'PCIE_USERCLK2_FREQ 250 PCIE_USERCLK_FREQ 250 RX_JTOL_FC 6.1862627 RX_JTOL_LF_SLOPE -20 RX_BUFFER_BYPASS_MODE Fast_Sync RX_BUFFER_BYPASS_MODE_LANE MULTI RX_BUFFER_RESET_ON_CB_CHANGE ENABLE', 'RX_BUFFER_RESET_ON_COMMAALIGN DISABLE RX_BUFFER_RESET_ON_RATE_CHANGE ENABLE RESET_SEQUENCE_INTERVAL 0 RX_COMMA_PRESET NONE RX_COMMA_VALID_ONLY 0 GT_DIRECTION SIMPLEX_TX TX_PAM_SEL NRZ TX_HD_EN 0', 'TX_GRAY_BYP true TX_GRAY_LITTLEENDIAN true TX_PRECODE_BYP true TX_PRECODE_LITTLEENDIAN false TX_LINE_RATE 1.62 TX_PLL_TYPE RPLL TX_REFCLK_FREQUENCY 270 TX_ACTUAL_REFCLK_FREQUENCY 270.000000000000', 'TX_FRACN_ENABLED false TX_FRACN_OVRD false TX_FRACN_NUMERATOR 0 TX_REFCLK_SOURCE R0 TX_DATA_ENCODING RAW TX_USER_DATA_WIDTH 16 TX_INT_DATA_WIDTH 16 TX_BUFFER_MODE 1 TX_BUFFER_BYPASS_MODE Fast_Sync', 'TX_PIPM_ENABLE false TX_OUTCLK_SOURCE TXPROGDIVCLK TXPROGDIV_FREQ_ENABLE true TXPROGDIV_FREQ_SOURCE RPLL TXPROGDIV_FREQ_VAL 101.250 TX_DIFF_SWING_EMPH_MODE CUSTOM TX_64B66B_SCRAMBLER false', 'TX_64B66B_ENCODER false TX_64B66B_CRC false TX_RATE_GROUP A TX_LANE_DESKEW_HDMI_ENABLE false TX_BUFFER_RESET_ON_RATE_CHANGE ENABLE GT_TYPE GTY']} \
  CONFIG.PROT1_LR10_SETTINGS {NA NA} \
  CONFIG.PROT1_LR11_SETTINGS {NA NA} \
  CONFIG.PROT1_LR12_SETTINGS {NA NA} \
  CONFIG.PROT1_LR13_SETTINGS {NA NA} \
  CONFIG.PROT1_LR14_SETTINGS {NA NA} \
  CONFIG.PROT1_LR15_SETTINGS {NA NA} \
  CONFIG.PROT1_LR1_SETTINGS {['PRESET None RX_PAM_SEL NRZ RX_HD_EN 0 RX_GRAY_BYP true RX_GRAY_LITTLEENDIAN true RX_PRECODE_BYP true RX_PRECODE_LITTLEENDIAN false INTERNAL_PRESET None RX_LINE_RATE 10.3125 RX_PLL_TYPE LCPLL', 'RX_REFCLK_FREQUENCY 156.25 RX_ACTUAL_REFCLK_FREQUENCY 156.250000000000 RX_FRACN_ENABLED false RX_FRACN_OVRD false RX_FRACN_NUMERATOR 0 RX_REFCLK_SOURCE R0 RX_DATA_DECODING RAW RX_USER_DATA_WIDTH 32', 'RX_INT_DATA_WIDTH 32 RX_BUFFER_MODE 1 RX_OUTCLK_SOURCE RXOUTCLKPMA RXPROGDIV_FREQ_ENABLE false RXPROGDIV_FREQ_SOURCE LCPLL RXPROGDIV_FREQ_VAL 322.265625 RXRECCLK_FREQ_ENABLE false RXRECCLK_FREQ_VAL 0', 'INS_LOSS_NYQ 20 RX_EQ_MODE AUTO RX_COUPLING AC RX_TERMINATION PROGRAMMABLE RX_RATE_GROUP A RX_TERMINATION_PROG_VALUE 800 RX_PPM_OFFSET 0 RX_64B66B_DESCRAMBLER false RX_64B66B_DECODER false', 'RX_64B66B_CRC false OOB_ENABLE false RX_COMMA_ALIGN_WORD 1 RX_COMMA_SHOW_REALIGN_ENABLE true PCIE_ENABLE false RX_COMMA_P_ENABLE false RX_COMMA_M_ENABLE false RX_COMMA_DOUBLE_ENABLE false', 'RX_COMMA_P_VAL 0101111100 RX_COMMA_M_VAL 1010000011 RX_COMMA_MASK 0000000000 RX_SLIDE_MODE OFF RX_SSC_PPM 0 RX_CB_NUM_SEQ 0 RX_CB_LEN_SEQ 1 RX_CB_MAX_SKEW 1 RX_CB_MAX_LEVEL 1 RX_CB_MASK 00000000', 'RX_CB_VAL 00000000000000000000000000000000000000000000000000000000000000000000000000000000 RX_CB_K 00000000 RX_CB_DISP 00000000 RX_CB_MASK_0_0 false RX_CB_VAL_0_0 00000000 RX_CB_K_0_0 false', 'RX_CB_DISP_0_0 false RX_CB_MASK_0_1 false RX_CB_VAL_0_1 00000000 RX_CB_K_0_1 false RX_CB_DISP_0_1 false RX_CB_MASK_0_2 false RX_CB_VAL_0_2 00000000 RX_CB_K_0_2 false RX_CB_DISP_0_2 false', 'RX_CB_MASK_0_3 false RX_CB_VAL_0_3 00000000 RX_CB_K_0_3 false RX_CB_DISP_0_3 false RX_CB_MASK_1_0 false RX_CB_VAL_1_0 00000000 RX_CB_K_1_0 false RX_CB_DISP_1_0 false RX_CB_MASK_1_1 false RX_CB_VAL_1_1', '00000000 RX_CB_K_1_1 false RX_CB_DISP_1_1 false RX_CB_MASK_1_2 false RX_CB_VAL_1_2 00000000 RX_CB_K_1_2 false RX_CB_DISP_1_2 false RX_CB_MASK_1_3 false RX_CB_VAL_1_3 00000000 RX_CB_K_1_3 false', 'RX_CB_DISP_1_3 false RX_CC_NUM_SEQ 0 RX_CC_LEN_SEQ 1 RX_CC_PERIODICITY 5000 RX_CC_KEEP_IDLE DISABLE RX_CC_PRECEDENCE ENABLE RX_CC_REPEAT_WAIT 0 RX_CC_MASK 00000000 RX_CC_VAL', '00000000000000000000000000000000000000000000000000000000000000000000000000000000 RX_CC_K 00000000 RX_CC_DISP 00000000 RX_CC_MASK_0_0 false RX_CC_VAL_0_0 00000000 RX_CC_K_0_0 false RX_CC_DISP_0_0 false', 'RX_CC_MASK_0_1 false RX_CC_VAL_0_1 00000000 RX_CC_K_0_1 false RX_CC_DISP_0_1 false RX_CC_MASK_0_2 false RX_CC_VAL_0_2 00000000 RX_CC_K_0_2 false RX_CC_DISP_0_2 false RX_CC_MASK_0_3 false RX_CC_VAL_0_3', '00000000 RX_CC_K_0_3 false RX_CC_DISP_0_3 false RX_CC_MASK_1_0 false RX_CC_VAL_1_0 00000000 RX_CC_K_1_0 false RX_CC_DISP_1_0 false RX_CC_MASK_1_1 false RX_CC_VAL_1_1 00000000 RX_CC_K_1_1 false', 'RX_CC_DISP_1_1 false RX_CC_MASK_1_2 false RX_CC_VAL_1_2 00000000 RX_CC_K_1_2 false RX_CC_DISP_1_2 false RX_CC_MASK_1_3 false RX_CC_VAL_1_3 00000000 RX_CC_K_1_3 false RX_CC_DISP_1_3 false', 'PCIE_USERCLK2_FREQ 250 PCIE_USERCLK_FREQ 250 RX_JTOL_FC 6.1862627 RX_JTOL_LF_SLOPE -20 RX_BUFFER_BYPASS_MODE Fast_Sync RX_BUFFER_BYPASS_MODE_LANE MULTI RX_BUFFER_RESET_ON_CB_CHANGE ENABLE', 'RX_BUFFER_RESET_ON_COMMAALIGN DISABLE RX_BUFFER_RESET_ON_RATE_CHANGE ENABLE RESET_SEQUENCE_INTERVAL 0 RX_COMMA_PRESET NONE RX_COMMA_VALID_ONLY 0 GT_DIRECTION SIMPLEX_TX TX_PAM_SEL NRZ TX_HD_EN 0', 'TX_GRAY_BYP true TX_GRAY_LITTLEENDIAN true TX_PRECODE_BYP true TX_PRECODE_LITTLEENDIAN false TX_LINE_RATE 2.7 TX_PLL_TYPE RPLL TX_REFCLK_FREQUENCY 270 TX_ACTUAL_REFCLK_FREQUENCY 270.000000000000', 'TX_FRACN_ENABLED false TX_FRACN_OVRD false TX_FRACN_NUMERATOR 0 TX_REFCLK_SOURCE R0 TX_DATA_ENCODING RAW TX_USER_DATA_WIDTH 16 TX_INT_DATA_WIDTH 16 TX_BUFFER_MODE 1 TX_BUFFER_BYPASS_MODE Fast_Sync', 'TX_PIPM_ENABLE false TX_OUTCLK_SOURCE TXPROGDIVCLK TXPROGDIV_FREQ_ENABLE true TXPROGDIV_FREQ_SOURCE RPLL TXPROGDIV_FREQ_VAL 168.750 TX_DIFF_SWING_EMPH_MODE CUSTOM TX_64B66B_SCRAMBLER false', 'TX_64B66B_ENCODER false TX_64B66B_CRC false TX_RATE_GROUP A TX_LANE_DESKEW_HDMI_ENABLE false TX_BUFFER_RESET_ON_RATE_CHANGE ENABLE GT_TYPE GTY']} \
  CONFIG.PROT1_LR2_SETTINGS {['PRESET None RX_PAM_SEL NRZ RX_HD_EN 0 RX_GRAY_BYP true RX_GRAY_LITTLEENDIAN true RX_PRECODE_BYP true RX_PRECODE_LITTLEENDIAN false INTERNAL_PRESET None RX_LINE_RATE 10.3125 RX_PLL_TYPE LCPLL', 'RX_REFCLK_FREQUENCY 156.25 RX_ACTUAL_REFCLK_FREQUENCY 156.250000000000 RX_FRACN_ENABLED false RX_FRACN_OVRD false RX_FRACN_NUMERATOR 0 RX_REFCLK_SOURCE R0 RX_DATA_DECODING RAW RX_USER_DATA_WIDTH 32', 'RX_INT_DATA_WIDTH 32 RX_BUFFER_MODE 1 RX_OUTCLK_SOURCE RXOUTCLKPMA RXPROGDIV_FREQ_ENABLE false RXPROGDIV_FREQ_SOURCE LCPLL RXPROGDIV_FREQ_VAL 322.265625 RXRECCLK_FREQ_ENABLE false RXRECCLK_FREQ_VAL 0', 'INS_LOSS_NYQ 20 RX_EQ_MODE AUTO RX_COUPLING AC RX_TERMINATION PROGRAMMABLE RX_RATE_GROUP A RX_TERMINATION_PROG_VALUE 800 RX_PPM_OFFSET 0 RX_64B66B_DESCRAMBLER false RX_64B66B_DECODER false', 'RX_64B66B_CRC false OOB_ENABLE false RX_COMMA_ALIGN_WORD 1 RX_COMMA_SHOW_REALIGN_ENABLE true PCIE_ENABLE false RX_COMMA_P_ENABLE false RX_COMMA_M_ENABLE false RX_COMMA_DOUBLE_ENABLE false', 'RX_COMMA_P_VAL 0101111100 RX_COMMA_M_VAL 1010000011 RX_COMMA_MASK 0000000000 RX_SLIDE_MODE OFF RX_SSC_PPM 0 RX_CB_NUM_SEQ 0 RX_CB_LEN_SEQ 1 RX_CB_MAX_SKEW 1 RX_CB_MAX_LEVEL 1 RX_CB_MASK 00000000', 'RX_CB_VAL 00000000000000000000000000000000000000000000000000000000000000000000000000000000 RX_CB_K 00000000 RX_CB_DISP 00000000 RX_CB_MASK_0_0 false RX_CB_VAL_0_0 00000000 RX_CB_K_0_0 false', 'RX_CB_DISP_0_0 false RX_CB_MASK_0_1 false RX_CB_VAL_0_1 00000000 RX_CB_K_0_1 false RX_CB_DISP_0_1 false RX_CB_MASK_0_2 false RX_CB_VAL_0_2 00000000 RX_CB_K_0_2 false RX_CB_DISP_0_2 false', 'RX_CB_MASK_0_3 false RX_CB_VAL_0_3 00000000 RX_CB_K_0_3 false RX_CB_DISP_0_3 false RX_CB_MASK_1_0 false RX_CB_VAL_1_0 00000000 RX_CB_K_1_0 false RX_CB_DISP_1_0 false RX_CB_MASK_1_1 false RX_CB_VAL_1_1', '00000000 RX_CB_K_1_1 false RX_CB_DISP_1_1 false RX_CB_MASK_1_2 false RX_CB_VAL_1_2 00000000 RX_CB_K_1_2 false RX_CB_DISP_1_2 false RX_CB_MASK_1_3 false RX_CB_VAL_1_3 00000000 RX_CB_K_1_3 false', 'RX_CB_DISP_1_3 false RX_CC_NUM_SEQ 0 RX_CC_LEN_SEQ 1 RX_CC_PERIODICITY 5000 RX_CC_KEEP_IDLE DISABLE RX_CC_PRECEDENCE ENABLE RX_CC_REPEAT_WAIT 0 RX_CC_MASK 00000000 RX_CC_VAL', '00000000000000000000000000000000000000000000000000000000000000000000000000000000 RX_CC_K 00000000 RX_CC_DISP 00000000 RX_CC_MASK_0_0 false RX_CC_VAL_0_0 00000000 RX_CC_K_0_0 false RX_CC_DISP_0_0 false', 'RX_CC_MASK_0_1 false RX_CC_VAL_0_1 00000000 RX_CC_K_0_1 false RX_CC_DISP_0_1 false RX_CC_MASK_0_2 false RX_CC_VAL_0_2 00000000 RX_CC_K_0_2 false RX_CC_DISP_0_2 false RX_CC_MASK_0_3 false RX_CC_VAL_0_3', '00000000 RX_CC_K_0_3 false RX_CC_DISP_0_3 false RX_CC_MASK_1_0 false RX_CC_VAL_1_0 00000000 RX_CC_K_1_0 false RX_CC_DISP_1_0 false RX_CC_MASK_1_1 false RX_CC_VAL_1_1 00000000 RX_CC_K_1_1 false', 'RX_CC_DISP_1_1 false RX_CC_MASK_1_2 false RX_CC_VAL_1_2 00000000 RX_CC_K_1_2 false RX_CC_DISP_1_2 false RX_CC_MASK_1_3 false RX_CC_VAL_1_3 00000000 RX_CC_K_1_3 false RX_CC_DISP_1_3 false', 'PCIE_USERCLK2_FREQ 250 PCIE_USERCLK_FREQ 250 RX_JTOL_FC 6.1862627 RX_JTOL_LF_SLOPE -20 RX_BUFFER_BYPASS_MODE Fast_Sync RX_BUFFER_BYPASS_MODE_LANE MULTI RX_BUFFER_RESET_ON_CB_CHANGE ENABLE', 'RX_BUFFER_RESET_ON_COMMAALIGN DISABLE RX_BUFFER_RESET_ON_RATE_CHANGE ENABLE RESET_SEQUENCE_INTERVAL 0 RX_COMMA_PRESET NONE RX_COMMA_VALID_ONLY 0 GT_DIRECTION SIMPLEX_TX TX_PAM_SEL NRZ TX_HD_EN 0', 'TX_GRAY_BYP true TX_GRAY_LITTLEENDIAN true TX_PRECODE_BYP true TX_PRECODE_LITTLEENDIAN false TX_LINE_RATE 5.4 TX_PLL_TYPE RPLL TX_REFCLK_FREQUENCY 270 TX_ACTUAL_REFCLK_FREQUENCY 270.000000000000', 'TX_FRACN_ENABLED false TX_FRACN_OVRD false TX_FRACN_NUMERATOR 0 TX_REFCLK_SOURCE R0 TX_DATA_ENCODING RAW TX_USER_DATA_WIDTH 16 TX_INT_DATA_WIDTH 16 TX_BUFFER_MODE 1 TX_BUFFER_BYPASS_MODE Fast_Sync', 'TX_PIPM_ENABLE false TX_OUTCLK_SOURCE TXPROGDIVCLK TXPROGDIV_FREQ_ENABLE true TXPROGDIV_FREQ_SOURCE RPLL TXPROGDIV_FREQ_VAL 337.500 TX_DIFF_SWING_EMPH_MODE CUSTOM TX_64B66B_SCRAMBLER false', 'TX_64B66B_ENCODER false TX_64B66B_CRC false TX_RATE_GROUP A TX_LANE_DESKEW_HDMI_ENABLE false TX_BUFFER_RESET_ON_RATE_CHANGE ENABLE GT_TYPE GTY']} \
  CONFIG.PROT1_LR3_SETTINGS {['PRESET None RX_PAM_SEL NRZ RX_HD_EN 0 RX_GRAY_BYP true RX_GRAY_LITTLEENDIAN true RX_PRECODE_BYP true RX_PRECODE_LITTLEENDIAN false INTERNAL_PRESET None RX_LINE_RATE 10.3125 RX_PLL_TYPE LCPLL', 'RX_REFCLK_FREQUENCY 156.25 RX_ACTUAL_REFCLK_FREQUENCY 156.250000000000 RX_FRACN_ENABLED false RX_FRACN_OVRD false RX_FRACN_NUMERATOR 0 RX_REFCLK_SOURCE R0 RX_DATA_DECODING RAW RX_USER_DATA_WIDTH 32', 'RX_INT_DATA_WIDTH 32 RX_BUFFER_MODE 1 RX_OUTCLK_SOURCE RXOUTCLKPMA RXPROGDIV_FREQ_ENABLE false RXPROGDIV_FREQ_SOURCE LCPLL RXPROGDIV_FREQ_VAL 322.265625 RXRECCLK_FREQ_ENABLE false RXRECCLK_FREQ_VAL 0', 'INS_LOSS_NYQ 20 RX_EQ_MODE AUTO RX_COUPLING AC RX_TERMINATION PROGRAMMABLE RX_RATE_GROUP A RX_TERMINATION_PROG_VALUE 800 RX_PPM_OFFSET 0 RX_64B66B_DESCRAMBLER false RX_64B66B_DECODER false', 'RX_64B66B_CRC false OOB_ENABLE false RX_COMMA_ALIGN_WORD 1 RX_COMMA_SHOW_REALIGN_ENABLE true PCIE_ENABLE false RX_COMMA_P_ENABLE false RX_COMMA_M_ENABLE false RX_COMMA_DOUBLE_ENABLE false', 'RX_COMMA_P_VAL 0101111100 RX_COMMA_M_VAL 1010000011 RX_COMMA_MASK 0000000000 RX_SLIDE_MODE OFF RX_SSC_PPM 0 RX_CB_NUM_SEQ 0 RX_CB_LEN_SEQ 1 RX_CB_MAX_SKEW 1 RX_CB_MAX_LEVEL 1 RX_CB_MASK 00000000', 'RX_CB_VAL 00000000000000000000000000000000000000000000000000000000000000000000000000000000 RX_CB_K 00000000 RX_CB_DISP 00000000 RX_CB_MASK_0_0 false RX_CB_VAL_0_0 00000000 RX_CB_K_0_0 false', 'RX_CB_DISP_0_0 false RX_CB_MASK_0_1 false RX_CB_VAL_0_1 00000000 RX_CB_K_0_1 false RX_CB_DISP_0_1 false RX_CB_MASK_0_2 false RX_CB_VAL_0_2 00000000 RX_CB_K_0_2 false RX_CB_DISP_0_2 false', 'RX_CB_MASK_0_3 false RX_CB_VAL_0_3 00000000 RX_CB_K_0_3 false RX_CB_DISP_0_3 false RX_CB_MASK_1_0 false RX_CB_VAL_1_0 00000000 RX_CB_K_1_0 false RX_CB_DISP_1_0 false RX_CB_MASK_1_1 false RX_CB_VAL_1_1', '00000000 RX_CB_K_1_1 false RX_CB_DISP_1_1 false RX_CB_MASK_1_2 false RX_CB_VAL_1_2 00000000 RX_CB_K_1_2 false RX_CB_DISP_1_2 false RX_CB_MASK_1_3 false RX_CB_VAL_1_3 00000000 RX_CB_K_1_3 false', 'RX_CB_DISP_1_3 false RX_CC_NUM_SEQ 0 RX_CC_LEN_SEQ 1 RX_CC_PERIODICITY 5000 RX_CC_KEEP_IDLE DISABLE RX_CC_PRECEDENCE ENABLE RX_CC_REPEAT_WAIT 0 RX_CC_MASK 00000000 RX_CC_VAL', '00000000000000000000000000000000000000000000000000000000000000000000000000000000 RX_CC_K 00000000 RX_CC_DISP 00000000 RX_CC_MASK_0_0 false RX_CC_VAL_0_0 00000000 RX_CC_K_0_0 false RX_CC_DISP_0_0 false', 'RX_CC_MASK_0_1 false RX_CC_VAL_0_1 00000000 RX_CC_K_0_1 false RX_CC_DISP_0_1 false RX_CC_MASK_0_2 false RX_CC_VAL_0_2 00000000 RX_CC_K_0_2 false RX_CC_DISP_0_2 false RX_CC_MASK_0_3 false RX_CC_VAL_0_3', '00000000 RX_CC_K_0_3 false RX_CC_DISP_0_3 false RX_CC_MASK_1_0 false RX_CC_VAL_1_0 00000000 RX_CC_K_1_0 false RX_CC_DISP_1_0 false RX_CC_MASK_1_1 false RX_CC_VAL_1_1 00000000 RX_CC_K_1_1 false', 'RX_CC_DISP_1_1 false RX_CC_MASK_1_2 false RX_CC_VAL_1_2 00000000 RX_CC_K_1_2 false RX_CC_DISP_1_2 false RX_CC_MASK_1_3 false RX_CC_VAL_1_3 00000000 RX_CC_K_1_3 false RX_CC_DISP_1_3 false', 'PCIE_USERCLK2_FREQ 250 PCIE_USERCLK_FREQ 250 RX_JTOL_FC 6.1862627 RX_JTOL_LF_SLOPE -20 RX_BUFFER_BYPASS_MODE Fast_Sync RX_BUFFER_BYPASS_MODE_LANE MULTI RX_BUFFER_RESET_ON_CB_CHANGE ENABLE', 'RX_BUFFER_RESET_ON_COMMAALIGN DISABLE RX_BUFFER_RESET_ON_RATE_CHANGE ENABLE RESET_SEQUENCE_INTERVAL 0 RX_COMMA_PRESET NONE RX_COMMA_VALID_ONLY 0 GT_DIRECTION SIMPLEX_TX TX_PAM_SEL NRZ TX_HD_EN 0', 'TX_GRAY_BYP true TX_GRAY_LITTLEENDIAN true TX_PRECODE_BYP true TX_PRECODE_LITTLEENDIAN false TX_LINE_RATE 8.1 TX_PLL_TYPE RPLL TX_REFCLK_FREQUENCY 270 TX_ACTUAL_REFCLK_FREQUENCY 270.000000000000', 'TX_FRACN_ENABLED false TX_FRACN_OVRD false TX_FRACN_NUMERATOR 0 TX_REFCLK_SOURCE R0 TX_DATA_ENCODING RAW TX_USER_DATA_WIDTH 16 TX_INT_DATA_WIDTH 16 TX_BUFFER_MODE 1 TX_BUFFER_BYPASS_MODE Fast_Sync', 'TX_PIPM_ENABLE false TX_OUTCLK_SOURCE TXPROGDIVCLK TXPROGDIV_FREQ_ENABLE true TXPROGDIV_FREQ_SOURCE RPLL TXPROGDIV_FREQ_VAL 506.250 TX_DIFF_SWING_EMPH_MODE CUSTOM TX_64B66B_SCRAMBLER false', 'TX_64B66B_ENCODER false TX_64B66B_CRC false TX_RATE_GROUP A TX_LANE_DESKEW_HDMI_ENABLE false TX_BUFFER_RESET_ON_RATE_CHANGE ENABLE GT_TYPE GTY']} \
  CONFIG.PROT1_LR4_SETTINGS {NA NA} \
  CONFIG.PROT1_LR5_SETTINGS {NA NA} \
  CONFIG.PROT1_LR6_SETTINGS {NA NA} \
  CONFIG.PROT1_LR7_SETTINGS {NA NA} \
  CONFIG.PROT1_LR8_SETTINGS {NA NA} \
  CONFIG.PROT1_LR9_SETTINGS {NA NA} \
  CONFIG.PROT1_NO_OF_TX_LANES 4 \
  CONFIG.PROT1_RX_MASTERCLK_SRC None \
  CONFIG.PROT1_TX_MASTERCLK_SRC TX0 \
  CONFIG.QUAD_USAGE {['TX_QUAD_CH {', 'TXQuad_0_/gt_quad/gt_quad_base {/gt_quad/gt_quad_base dpss_vck190_pt_dptx_gt_ip0_0.IP_CH0,dpss_vck190_pt_dptx_gt_ip0_0.IP_CH1,dpss_vck190_pt_dptx_gt_ip0_0.IP_CH2,dpss_vck190_pt_dptx_gt_ip0_0.IP_CH3', 'MSTRCLK 1,0,0,0 IS_CURRENT_QUAD 1}', '}', 'RX_QUAD_CH {', 'RXQuad_0_/gt_quad/gt_quad_base {/gt_quad/gt_quad_base dpss_vck190_pt_dprx_gt_ip0_0.IP_CH0,dpss_vck190_pt_dprx_gt_ip0_0.IP_CH1,dpss_vck190_pt_dprx_gt_ip0_0.IP_CH2,dpss_vck190_pt_dprx_gt_ip0_0.IP_CH3', 'MSTRCLK 1,0,0,0 IS_CURRENT_QUAD 1}', '}']} \
  CONFIG.REFCLK_LIST {{/refclk_clk_p[0]} {/refclk_clk_p[0]}} \
  CONFIG.REFCLK_STRING {['HSCLK0_LCPLLGTREFCLK0 refclk_PROT0_R0_270_MHz_unique1 HSCLK0_RPLLGTREFCLK0 refclk_PROT1_R0_270_MHz_unique1 HSCLK1_LCPLLGTREFCLK0 refclk_PROT0_R0_270_MHz_unique1 HSCLK1_RPLLGTREFCLK0', 'refclk_PROT1_R0_270_MHz_unique1']} \
  CONFIG.REG_CONF_INTF AXI_LITE \
  CONFIG.RX0_LANE_SEL PROT0 \
  CONFIG.RX1_LANE_SEL PROT0 \
  CONFIG.RX2_LANE_SEL PROT0 \
  CONFIG.RX3_LANE_SEL PROT0 \
  CONFIG.TX0_LANE_SEL PROT1 \
  CONFIG.TX1_LANE_SEL PROT1 \
  CONFIG.TX2_LANE_SEL PROT1 \
  CONFIG.TX3_LANE_SEL PROT1 \
] [get_bd_cells gt_quad_base]
create_bd_cell -type ip -vlnv xilinx.com:ip:bufg_gt:1.0 bufg_gt_1
create_bd_cell -type ip -vlnv xilinx.com:ip:util_ds_buf:2.2 util_ds_buf
set_property -dict {CONFIG.C_BUF_TYPE IBUFDSGTE} [get_bd_cells util_ds_buf]
create_bd_cell -type ip -vlnv xilinx.com:ip:bufg_gt:1.0 dptx_bufg_gt1
set_property -dict {CONFIG.FREQ_HZ 506.25} [get_bd_cells dptx_bufg_gt1]

# ---- hierarchy /dp_rx_hier_0 ----
current_bd_instance /dp_rx_hier_0
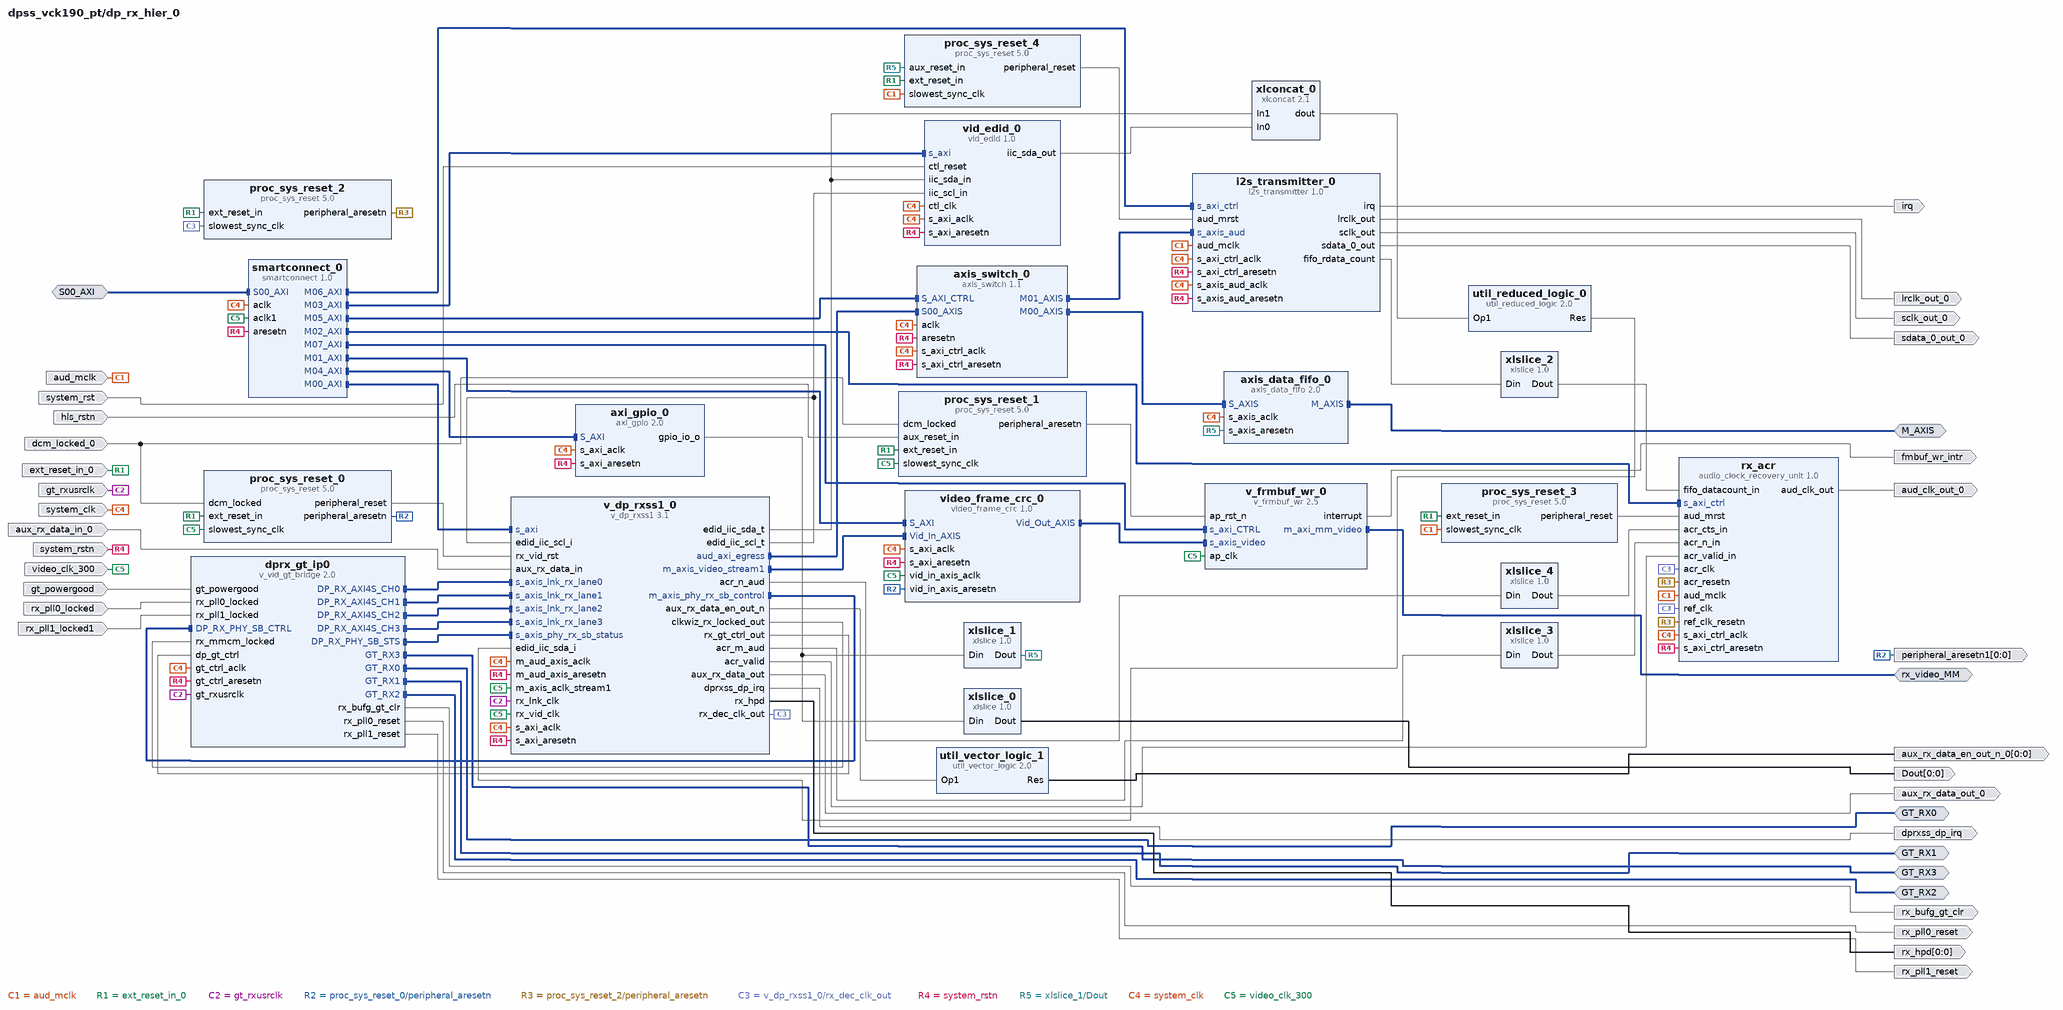
[diagram p2: block diagram inside /dp_rx_hier_0]
create_bd_intf_pin -mode Master -vlnv xilinx.com:interface:axis_rtl:1.0 M_AXIS
create_bd_intf_pin -mode Slave -vlnv xilinx.com:interface:aximm_rtl:1.0 S00_AXI
create_bd_intf_pin -mode Master -vlnv xilinx.com:interface:aximm_rtl:1.0 rx_video_MM
create_bd_intf_pin -mode Master -vlnv xilinx.com:interface:gt_rx_interface_rtl:1.0 GT_RX3
create_bd_intf_pin -mode Master -vlnv xilinx.com:interface:gt_rx_interface_rtl:1.0 GT_RX0
create_bd_intf_pin -mode Master -vlnv xilinx.com:interface:gt_rx_interface_rtl:1.0 GT_RX1
create_bd_intf_pin -mode Master -vlnv xilinx.com:interface:gt_rx_interface_rtl:1.0 GT_RX2
create_bd_pin -dir O -from 0 -to 0 Dout
create_bd_pin -dir O aud_clk_out_0
create_bd_pin -dir I -type clk aud_mclk
create_bd_pin -dir O -from 0 -to 0 aux_rx_data_en_out_n_0
create_bd_pin -dir I aux_rx_data_in_0
create_bd_pin -dir O aux_rx_data_out_0
create_bd_pin -dir I dcm_locked_0
create_bd_pin -dir O dprxss_dp_irq
create_bd_pin -dir I -type rst ext_reset_in_0
create_bd_pin -dir O -type intr fmbuf_wr_intr
create_bd_pin -dir I -type rst hls_rstn
create_bd_pin -dir O -type intr irq
create_bd_pin -dir O lrclk_out_0
create_bd_pin -dir O -from 0 -to 0 -type rst peripheral_aresetn1
create_bd_pin -dir O -from 0 -to 0 rx_hpd
create_bd_pin -dir O sclk_out_0
create_bd_pin -dir O sdata_0_out_0
create_bd_pin -dir I -type clk system_clk
create_bd_pin -dir I system_rst
create_bd_pin -dir I -type rst system_rstn
create_bd_pin -dir I -type clk video_clk_300
create_bd_pin -dir O -type rst rx_pll1_reset
create_bd_pin -dir I gt_powergood
create_bd_pin -dir O rx_bufg_gt_clr
create_bd_pin -dir I -type gt_usrclk gt_rxusrclk
create_bd_pin -dir O -type rst rx_pll0_reset
create_bd_pin -dir I rx_pll0_locked
create_bd_pin -dir I rx_pll1_locked1
